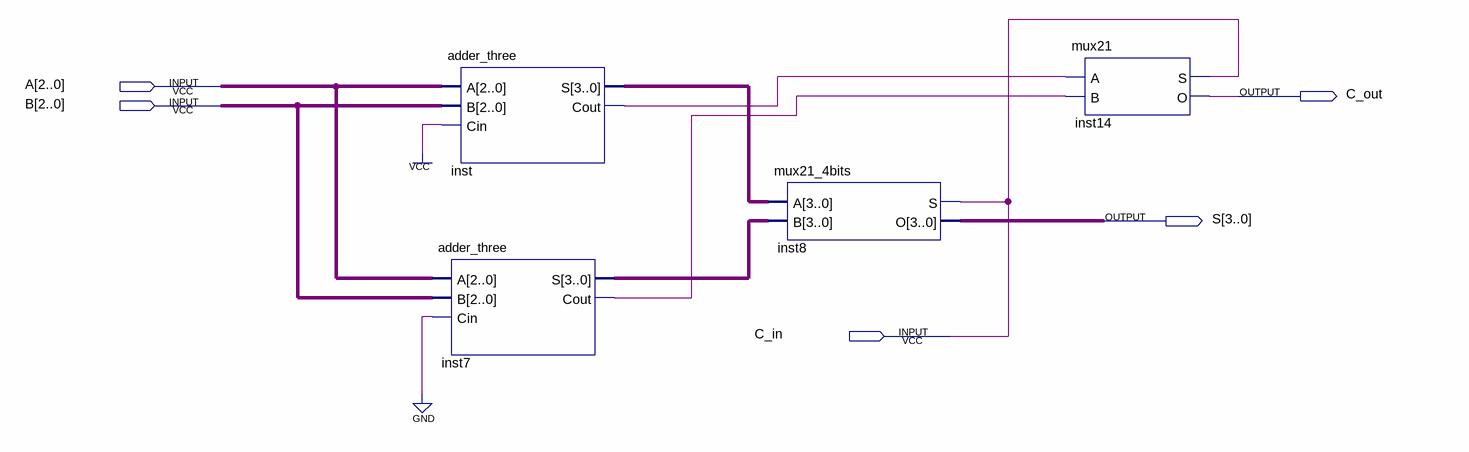
[diagram p0: schematic sheet]
// Quartus schematic adder_three_ins.bdf as structural Verilog: 4 symbols, 5 pins
module adder_three_ins (
  input  [2:0] A,
  input  [2:0] B,
  input  C_in,
  output C_out,
  output [3:0] S
);

  wire inst7_cout, inst_cout;
  wire [3:0] inst7_s, inst_s;

  adder_three inst (.A(A), .B(B), .Cin(1'b1), .S(inst_s), .Cout(inst_cout));
  adder_three inst7 (.A(A), .B(B), .Cin(1'b0), .S(inst7_s), .Cout(inst7_cout));
  mux21_4bits inst8 (.A(inst_s), .B(inst7_s), .O(S), .S(C_in));
  mux21 inst14 (.A(inst_cout), .B(inst7_cout), .O(C_out), .S(C_in));
endmodule
